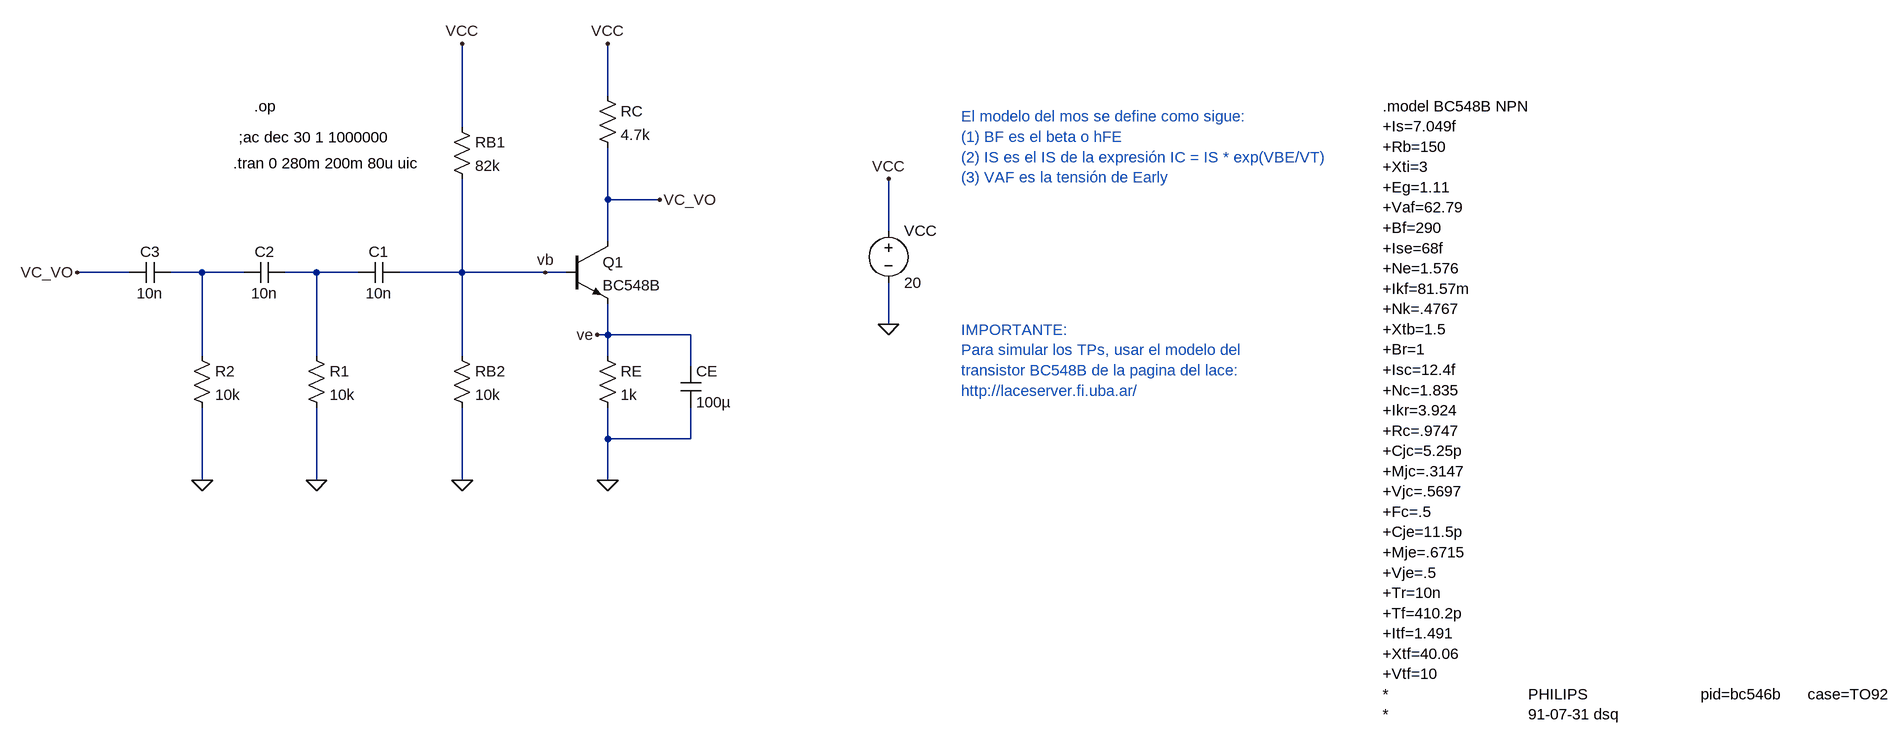
[diagram p0: schematic NPN.asc]
NPN.asc, the LTspice schematic file:
Version 4
SHEET 1 1900 872
WIRE -112 -176 -112 -256
WIRE -336 -128 -336 -256
WIRE -112 -16 -112 -96
WIRE -32 -16 -112 -16
WIRE 320 32 320 -48
WIRE -112 48 -112 -16
WIRE -848 96 -928 96
WIRE -736 96 -784 96
WIRE -672 96 -736 96
WIRE -560 96 -608 96
WIRE -496 96 -560 96
WIRE -336 96 -336 -48
WIRE -336 96 -432 96
WIRE -208 96 -336 96
WIRE -176 96 -208 96
WIRE 320 176 320 112
WIRE -112 192 -112 144
WIRE -112 192 -128 192
WIRE 16 192 -112 192
WIRE -736 224 -736 96
WIRE -560 224 -560 96
WIRE -336 224 -336 96
WIRE -112 224 -112 192
WIRE 16 240 16 192
WIRE -112 352 -112 304
WIRE 16 352 16 304
WIRE 16 352 -112 352
WIRE -736 416 -736 304
WIRE -560 416 -560 304
WIRE -336 416 -336 304
WIRE -112 416 -112 352
FLAG -208 96 vb
FLAG -128 192 ve
FLAG -112 416 0
FLAG -336 416 0
FLAG 320 176 0
FLAG 320 -48 VCC
FLAG -112 -256 VCC
FLAG -336 -256 VCC
FLAG -560 416 0
FLAG -736 416 0
FLAG -32 -16 VC_VO
FLAG -928 96 VC_VO
SYMBOL npn -176 48 R0
SYMATTR InstName Q1
SYMATTR Value BC548B
SYMBOL res -128 208 R0
SYMATTR InstName RE
SYMATTR Value 1k
SYMBOL res -128 -192 R0
SYMATTR InstName RC
SYMATTR Value 4.7k
SYMBOL res -352 208 R0
SYMATTR InstName RB2
SYMATTR Value 10k
SYMBOL res -352 -144 R0
SYMATTR InstName RB1
SYMATTR Value 82k
SYMBOL voltage 320 16 R0
WINDOW 123 0 0 Left 0
WINDOW 39 0 0 Left 0
SYMATTR InstName VCC
SYMATTR Value 20
SYMBOL cap 0 240 R0
SYMATTR InstName CE
SYMATTR Value 100µ
SYMBOL cap -432 80 R90
WINDOW 0 0 32 VBottom 2
WINDOW 3 32 32 VTop 2
SYMATTR InstName C1
SYMATTR Value 10n
SYMBOL cap -608 80 R90
WINDOW 0 0 32 VBottom 2
WINDOW 3 32 32 VTop 2
SYMATTR InstName C2
SYMATTR Value 10n
SYMBOL cap -784 80 R90
WINDOW 0 0 32 VBottom 2
WINDOW 3 32 32 VTop 2
SYMATTR InstName C3
SYMATTR Value 10n
SYMBOL res -576 208 R0
SYMATTR InstName R1
SYMATTR Value 10k
SYMBOL res -752 208 R0
SYMATTR InstName R2
SYMATTR Value 10k
TEXT 1080 -160 Left 2 !.model BC548B NPN\n+Is=7.049f\n+Rb=150\n+Xti=3\n+Eg=1.11\n+Vaf=62.79\n+Bf=290\n+Ise=68f\n+Ne=1.576\n+Ikf=81.57m\n+Nk=.4767\n+Xtb=1.5\n+Br=1\n+Isc=12.4f\n+Nc=1.835\n+Ikr=3.924\n+Rc=.9747\n+Cjc=5.25p\n+Mjc=.3147\n+Vjc=.5697\n+Fc=.5\n+Cje=11.5p\n+Mje=.6715\n+Vje=.5\n+Tr=10n\n+Tf=410.2p\n+Itf=1.491\n+Xtf=40.06\n+Vtf=10\n*                               PHILIPS                         pid=bc546b      case=TO92\n*                               91-07-31 dsq
TEXT 432 -144 Left 2 ;El modelo del mos se define como sigue:\n(1) BF es el beta o hFE\n(2) IS es el IS de la expresión IC = IS * exp(VBE/VT)\n(3) VAF es la tensión de Early
TEXT 432 184 Left 2 ;IMPORTANTE:\nPara simular los TPs, usar el modelo del \ntransistor BC548B de la pagina del lace:\nhttp://laceserver.fi.uba.ar/
TEXT -688 -72 Left 2 !.tran 0 280m 200m 80u uic
TEXT -680 -112 Left 2 !;ac dec 30 1 1000000
TEXT -656 -160 Left 2 !.op

The netlist it stands for:
* NPN.asc
Q1 VC_VO vb ve 0 BC548B
RE ve 0 1k
RC VCC VC_VO 4.7k
RB2 vb 0 10k
RB1 VCC vb 82k
VCC VCC 0 20
CE ve 0 100µ
C1 vb N002 10n
C2 N002 N001 10n
C3 N001 VC_VO 10n
R1 N002 0 10k
R2 N001 0 10k
.model NPN NPN
.model PNP PNP
.lib standard.bjt
.model BC548B NPN
+Is=7.049f
+Rb=150
+Xti=3
+Eg=1.11
+Vaf=62.79
+Bf=290
+Ise=68f
+Ne=1.576
+Ikf=81.57m
+Nk=.4767
+Xtb=1.5
+Br=1
+Isc=12.4f
+Nc=1.835
+Ikr=3.924
+Rc=.9747
+Cjc=5.25p
+Mjc=.3147
+Vjc=.5697
+Fc=.5
+Cje=11.5p
+Mje=.6715
+Vje=.5
+Tr=10n
+Tf=410.2p
+Itf=1.491
+Xtf=40.06
+Vtf=10
*                               PHILIPS                         pid=bc546b      case=TO92
*                               91-07-31 dsq
* El modelo del mos se define como sigue:
* (1) BF es el beta o hFE
* (2) IS es el IS de la expresión IC = IS * exp(VBE/VT)
* (3) VAF es la tensión de Early
* IMPORTANTE:
* Para simular los TPs, usar el modelo del
* transistor BC548B de la pagina del lace:
* http://laceserver.fi.uba.ar/
.tran 0 280m 200m 80u uic
;ac dec 30 1 1000000
.op
.backanno
.end